# Altium schematic sheet 20 Pin Header.SchDoc
size A4; SheetNumber: 1; SheetTotal: 1
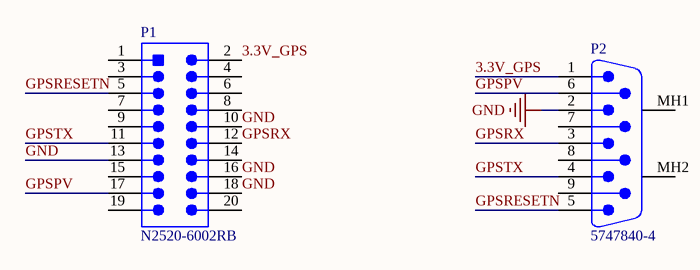
[diagram p0: 20 Pin Header.SchDoc]

## Parts
P1  N2520-6002RB  [3M-N2520-6002RB_V]
P2  5747840-4  [TECO-5747840-4_V]

## Nets
GND: P1.10(Signal_and_power_ground) P1.13(Signal_and_power_ground) P1.16(Signal_and_power_ground) P1.18(Signal_and_power_ground) P2.2
3.3V_GPS: P1.2(Supply_voltage_input) P2.1
GPSPV: P1.17(Position_valid_indicator) P2.6
GPSRESETN: P1.5(Reset_input) P2.5
GPSRX: P1.12(COM1_recieve_data) P2.3
GPSTX: P1.11(COM1_transmit_data) P2.4

Not connected (* = marked no-connect by the designer): P1 1(Antenna_power_input) 3(USB_data_(-)) 4(USB_data_(+)_/_COM3_receive_data) 6(Variable_frequency_output_/_CAN1_receive_data) 7(Event_2_input_/_CAN_1_transmit_data) 8(CAN2_receive_data) 9(Event_1_input_/__COM3_transmit_data) 14(COM2_transmit_data) 15(COM2_receive_data) 19(Timemark_output,_synchronous_to_GPS_time) 20(CAN2_transmit_data); P2 7 8 9 MH1 MH2

## Library data of the parts
P1 = CMP-2000-06796-2: Male Header, Pitch 2.54 mm, 2 x 10 Position, Height 9.91 mm, Tail Length 2.84 mm, -55 to 105 degC, RoHS; Manufacturer: 3MInterconnectSolutions; Number of Contacts: 20; Pitch: 2.54mm; Gender: HDR; Termination Method: Solder; Datasheet URL: https://datasheet.ciiva.com/11750/0900766b807b18da-11750722.pdf; Category: ConnectorHeadersandPCBReceptacles; Mounting Technology: ThroughHole; Contact Plating: GoldOverNickel; Package Reference: N2520-6002RB; Datasheet Version: 05/2007; Number of Rows: 2; Manufacturer URL: http://www.3m.com/; Package Description: Male Header, Pitch 2.54 mm, 2 x 10 Position, Height 9.91 mm, Tail Length 2.84 mm; Type: ShroudedHeader
P2 = CMP-2000-05648-1: Male D-Sub Connector, Pitch 1.37 mm, 9 Position, Height 12.93 mm, Tail Length 3.55 mm, -55 to 105 degC, RoHS, Tray; Manufacturer: TE Connectivity; Current Rating: 6A; 3D Model: 5747840-4.pdf; Connector Type: Plug,MalePins; Catalog Drawings: AMPD-SubMale.318; Other Names: A32092; Product Training Modules: AMPLIMITED-SubConnectors; Number of Positions: 9; Dynamic Catalog: AMPLIMITEHD-20Series; Flange Feature: Housing/Shell(4-40); Mating Products: 5-747905-7-ND / -CONND-SUBRCPT9POSVERTSLD / 5-787355-1-ND / -CONNRCPT9POSVERTSOLDERCUP / 5746861-4-ND / -CONNRECEPT9POSGOLDIDC / A32510-ND / -CONND-SUBRCPT9POSSLDCUPAU / AFL09B-ND / -CONND-SUBRECEPT9POS30GOLD / A31975-ND / -CONND-SUBRECEPT9P22-26AWGAU / A31974-ND / -CONND-SUBRECEPT9P20-22AWGAU / A31973-ND / -CONND-SUBRECEPT9P26-30AWGAU / A31931-ND / -CONND-SUBRCPT9POS22-26AWGAU; Featured Product: AMPLIMITED-SubminiatureConnectors; Voltage Rating: 125V; Connector Style: D-Sub; Mounting Technology: ThroughHole; Features: BoardLock,GroundStrap,GroundingIndents; Operating Temperature: -55°C~105°C; Standard Package: 130; Termination: Solder; Contact Finish: Gold; Family: D-SubConnectors; Package Reference: 5747840-4; Package Description: 9-Pin Through Hole Device, Body 30.81 x 18.62 mm, Pitch 1.37 mm; Category: Connectors,Interconnects; Series: AMPLIMITEHD-20; Manufacturer URL: http://www.te.com/; Shell Size, Connector Layout: 1(DE,E); Color: Black; RoHS Information: 5747840-4StatementofCompliance; Shell Material, Finish: Steel,TinPlated; Datasheet URL: http://www.te.com/commerce/DocumentDelivery/DDEController?Action=showdoc&DocId=Customer+Drawing%7F5747840%7FD%7Fpdf%7FEnglish%7FENG_CD_5747840_D.pdf%7F5747840-4; Contact Finish Thickness: Flash; Datasheet Version: Rev. D, 01/2013; Mounting Type: ThroughHole,RightAngle; Number of Rows: 2; Contact Type: Signal